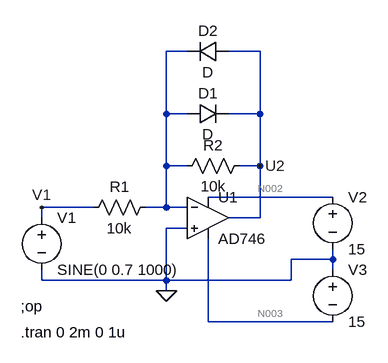
[diagram p0: schematic compressor.asc]
compressor.asc, the LTspice schematic file:
Version 4
SHEET 1 880 680
WIRE 160 -128 128 -128
WIRE 272 -128 224 -128
WIRE 128 -32 128 -128
WIRE 160 -32 128 -32
WIRE 272 -32 272 -128
WIRE 272 -32 224 -32
WIRE 128 48 128 -32
WIRE 160 48 128 48
WIRE 272 48 272 -32
WIRE 272 48 240 48
WIRE 384 96 192 96
WIRE 16 112 -64 112
WIRE 128 112 128 48
WIRE 128 112 96 112
WIRE 160 112 128 112
WIRE -64 128 -64 112
WIRE 272 128 272 48
WIRE 272 128 224 128
WIRE 160 144 128 144
WIRE 384 192 384 176
WIRE 384 192 320 192
WIRE 384 208 384 192
WIRE -64 224 -64 208
WIRE 128 224 128 144
WIRE 128 224 -64 224
WIRE 320 224 320 192
WIRE 320 224 128 224
WIRE 128 240 128 224
WIRE 192 288 192 160
WIRE 384 288 192 288
FLAG 128 240 0
FLAG 272 48 U2
FLAG -64 112 V1
DATAFLAG 288 32 ""
SYMBOL res 112 96 R90
WINDOW 0 0 56 VBottom 2
WINDOW 3 32 56 VTop 2
SYMATTR InstName R1
SYMATTR Value 10k
SYMBOL res 144 64 R270
WINDOW 0 32 56 VTop 2
WINDOW 3 0 56 VBottom 2
SYMATTR InstName R2
SYMATTR Value 10k
SYMBOL voltage -64 112 R0
WINDOW 123 0 0 Left 0
WINDOW 39 0 0 Left 0
SYMATTR InstName V1
SYMATTR Value SINE(0 0.7 1000)
SYMBOL voltage 384 80 R0
WINDOW 123 0 0 Left 0
WINDOW 39 0 0 Left 0
SYMATTR InstName V2
SYMATTR Value 15
SYMBOL voltage 384 192 R0
WINDOW 123 0 0 Left 0
WINDOW 39 0 0 Left 0
SYMATTR InstName V3
SYMATTR Value 15
SYMBOL Opamps\\AD746 192 64 R0
SYMATTR InstName U1
SYMBOL diode 160 -16 R270
WINDOW 0 32 32 VTop 2
WINDOW 3 0 32 VBottom 2
SYMATTR InstName D1
SYMBOL diode 224 -144 R90
WINDOW 0 0 32 VBottom 2
WINDOW 3 32 32 VTop 2
SYMATTR InstName D2
TEXT -96 264 Left 2 !;op
TEXT -96 304 Left 2 !.tran 0 2m 0 1u

The netlist it stands for:
* compressor.asc
R1 N001 V1 10k
R2 N001 U2 10k
V1 V1 0 SINE(0 0.7 1000)
V2 N002 0 15
V3 0 N003 15
XU1 0 N001 N002 N003 U2 AD746  ; pins In+ In- V+ V- OUT
D1 N001 U2 D
D2 U2 N001 D
.model D D
.lib standard.dio
;op
.tran 0 2m 0 1u
.backanno
.end

* Results of the author's LTspice run, read from the files saved beside the schematic
* Operating Point, zero values left out:
*   V(u2) = 1.1 µV
*   V(n002) = 15 V
*   V(n003) = -15 V
*   I(R2) = -110 pA
*   I(V3) = -4.899 mA
*   I(V2) = -4.899 mA
*   Ix(u1:1) = 110 pA
*   Ix(u1:2) = 110 pA
*   Ix(u1:3) = 4.899 mA
*   Ix(u1:4) = -4.899 mA
*   Ix(u1:5) = -110 pA
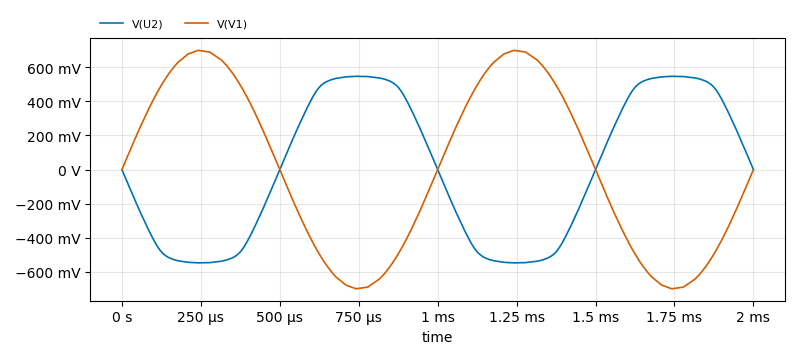
[diagram p1: Transient Analysis of compressor.asc, plotted from the saved traces]
* Transient Analysis, 1 run:
*   V(U2): min -546.9 mV, max 546.9 mV, average 526.8 nV, rms 430.8 mV, last 99.88 µV
*   V(V1): min -699 mV, max 699 mV, average 138.7 nV, rms 494.3 mV, last 0 V